# EasyEDA Pro project ProProject_Pet_Tracker_V2_Hardware_PRO.epro, schematic Pet_Tracker_V2_Main_Board
Create Date: 2024-06-01; Page Name: Main_board; Project Name: Pet_Tracker_V2_Hardware_PRO; Schematic Name: Pet_Tracker_V2_Main_Board; Update Date: 2024-06-06; Drawn: Simonas; Version: V1
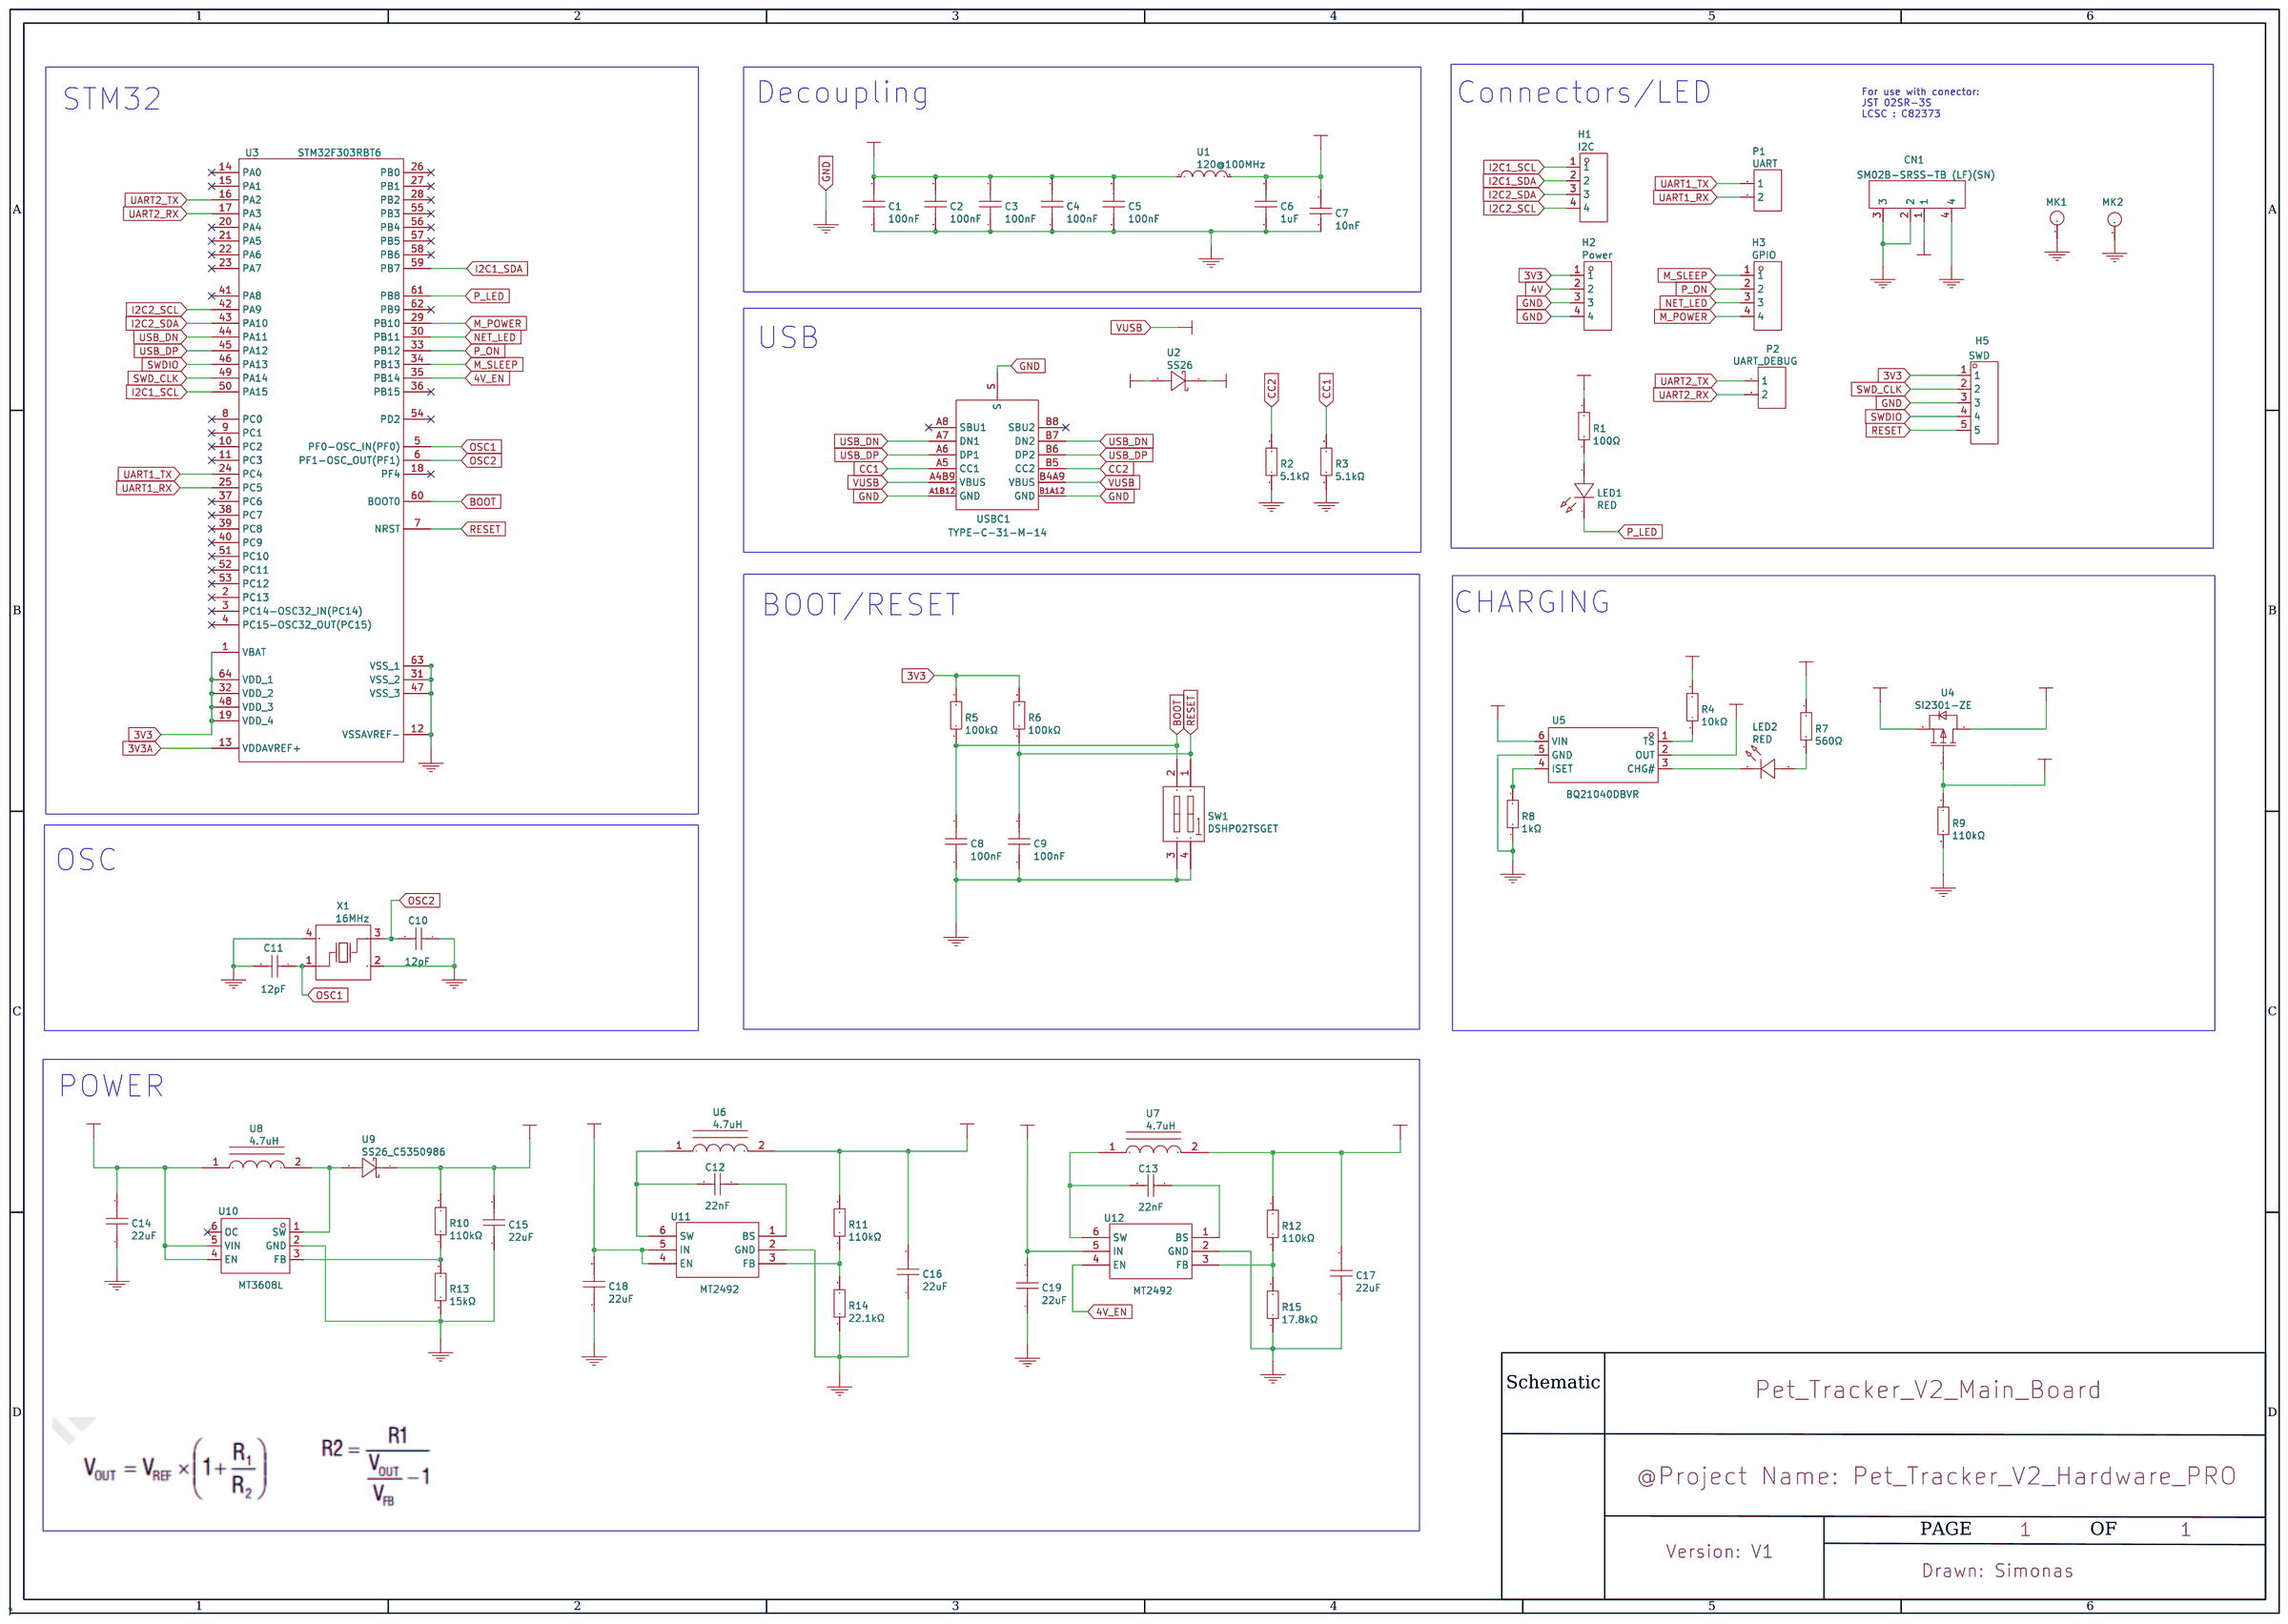
[diagram p0: schematic sheet]

## Parts
C1  100nF  [C0603]
C2  100nF  [C0603]
C3  100nF  [C0603]
C4  100nF  [C0603]
C5  100nF  [C0603]
C6  1uF  [C0603]
C7  10nF  [C0603]
C8  100nF  [C0603]
C9  100nF  [C0603]
C10  12pF  [C0603]
C11  12pF  [C0603]
C12  22nF  [C0603]
C13  22nF  [C0603]
C14  22uF  [C0603]
C15  22uF  [C0603]
C16  22uF  [C0603]
C17  22uF  [C0603]
C18  22uF  [C0603]
C19  22uF  [C0603]
CN1  SM02B-SRSS-TB (LF)(SN)  [CONN-SMD_2P-P1.00_SM02B-SRSS-TB-LF-SN]
H1  I2C  [HDR-TH_4P-P2.54-V-F]
H2  Power  [HDR-TH_4P-P2.54-V-F]
H3  GPIO  [HDR-TH_4P-P2.54-V-F]
H5  SWD  [HEADER_1X5_1.27MM]
LED1  RED  [LED0603-RD_RED]
LED2  RED  [LED0603-RD_RED]
MK1  Mounting_Hole_PAD  [MOUNTINGHOLE_2.2MM_M2_PAD]
MK2  Mounting_Hole_PAD  [MOUNTINGHOLE_2.2MM_M2_PAD]
P1  UART  [HDR-TH_2P-P2.54-V-F]
P2  UART_DEBUG  [HDR-TH_2P-P2.54-V-F]
R1  100Ω  [R0603]
R2  5.1kΩ  [R0603]
R3  5.1kΩ  [R0603]
R4  10kΩ  [R0603]
R5  100kΩ  [R0603]
R6  100kΩ  [R0603]
R7  560Ω  [R0603]
R8  1kΩ  [R0603]
R9  110kΩ  [R0603]
R10  110kΩ  [R0603]
R11  110kΩ  [R0603]
R12  110kΩ  [R0603]
R13  15kΩ  [R0603]
R14  22.1kΩ  [R0603]
R15  17.8kΩ  [R0603]
SW1  DSHP02TSGET  [SW-SMD_4P_DSHP02TSGET]
U1  120@100MHz  [L0603]
U2  SS26  [SMA_L4.3-W2.6-LS5.1-RD]
U3  STM32F303RBT6  [LQFP-64_L10.0-W10.0-P0.50-LS12.0-BL]
U4  SI2301-ZE  [SOT-23-3_L2.9-W1.3-P1.90-LS2.4-BR]
U5  BQ21040DBVR  [SOT-23-6_L2.9-W1.6-P0.95-LS2.8-BR]
U6  4.7uH  [IND-SMD_L4.4-W4.2]
U7  4.7uH  [IND-SMD_L4.4-W4.2]
U8  4.7uH  [IND-SMD_L4.4-W4.2]
U9  SS26_C5350986  [SMA_L4.3-W2.6-LS5.1-RD]
U10  MT3608L  [SOT-23-6_L2.9-W1.7-P0.95-LS2.8-BL]
U11  MT2492  [SOT-23-6_L2.9-W1.6-P0.95-LS2.8-BL]
U12  MT2492  [SOT-23-6_L2.9-W1.6-P0.95-LS2.8-BL]
USBC1  TYPE-C-31-M-14  [USB-C-SMD_12P-P0.50-H-F_TYPE-C-31-M-14]
X1  16MHz  [OSC-SMD_4P-L3.2-W2.5-BL]

## Library data of the parts
C1-C5 C8 C9 = 100nF: Supplier: LCSC; Manufacturer: SAMSUNG(三星); Manufacturer Part: CL10B104KB8NNNC; Supplier Part: C1591; JLCPCB Part Class: Extended Part
C6 = 1uF: Supplier: LCSC; Manufacturer Part: CL10A105KB8NNNC; Manufacturer: SAMSUNG(三星); Supplier Part: C15849; JLCPCB Part Class: Basic Part
C7 = 10nF: Supplier: LCSC; Manufacturer Part: CL10B103KB8NNNC; Manufacturer: SAMSUNG(三星); Supplier Part: C1589; JLCPCB Part Class: Extended Part
C10 C11 = 12pF: Supplier: LCSC; Manufacturer: YAGEO(国巨); Manufacturer Part: CC0603JRNPO9BN120; Supplier Part: C107034; JLCPCB Part Class: Extended Part
C12 C13 = 22nF: Supplier: LCSC; Manufacturer: FH(风华); Manufacturer Part: 0603B223K500NT; Supplier Part: C77571; JLCPCB Part Class: Extended Part
C14-C19 = 22uF: Supplier: LCSC; Manufacturer: SAMSUNG(三星); Manufacturer Part: CL10A226MQ8NRNC; Supplier Part: C59461; JLCPCB Part Class: Basic Part
CN1 = SM02B-SRSS-TB (LF)(SN): Supplier: LCSC; Supplier Part: C160402; Manufacturer: JST; Manufacturer Part: SM02B-SRSS-TB(LF)(SN); JLCPCB Part Class: Extended Part
H1 = I2C: Supplier: LCSC; Supplier Part: C2718488; Manufacturer: BOOMELE(博穆精密); Manufacturer Part: 2.54-1*4P母; JLCPCB Part Class: Extended Part
H2 = Power: Supplier: LCSC; Supplier Part: C2718488; Manufacturer: BOOMELE(博穆精密); Manufacturer Part: 2.54-1*4P母; JLCPCB Part Class: Extended Part
H3 = GPIO: Supplier: LCSC; Supplier Part: C2718488; Manufacturer: BOOMELE(博穆精密); Manufacturer Part: 2.54-1*4P母; JLCPCB Part Class: Extended Part
H5 = SWD: Supplier: LCSC; Manufacturer: null; Manufacturer Part: 排针 1*4P; Supplier Part: C59481; JLCPCB Part Class: Extended Part
LED1 LED2 = RED: Supplier: LCSC; Supplier Part: C965799; Manufacturer: XINGLIGHT(成兴光); Manufacturer Part: XL-1608SURC-06; JLCPCB Part Class: Extended Part
MK1 MK2 = Mounting_Hole_PAD: license: https://www.gnu.org/licenses/lgpl-2.1.html
P1 = UART: Supplier: LCSC; Manufacturer: BOOMELE(博穆精密); Manufacturer Part: 2.54-1*2P母; Supplier Part: C49661; JLCPCB Part Class: Extended Part
P2 = UART_DEBUG: Supplier: LCSC; Manufacturer: BOOMELE(博穆精密); Manufacturer Part: 2.54-1*2P母; Supplier Part: C49661; JLCPCB Part Class: Extended Part
R1 = 100Ω: Supplier: LCSC; Manufacturer: YAGEO(国巨); Manufacturer Part: RC0603FR-07100RL; Supplier Part: C105588; JLCPCB Part Class: Extended Part
R2 R3 = 5.1kΩ: Supplier: LCSC; Manufacturer Part: 0603WAF5101T5E; Manufacturer: UNI-ROYAL(厚声); Supplier Part: C23186; JLCPCB Part Class: Basic Part
R4 = 10kΩ: Supplier: LCSC; Manufacturer: YAGEO(国巨); Manufacturer Part: RC0603FR-0710KL; Supplier Part: C98220; JLCPCB Part Class: Extended Part
R5 R6 = 100kΩ: Supplier: LCSC; Supplier Part: C14675; Manufacturer: YAGEO(国巨); Manufacturer Part: RC0603FR-07100KL; JLCPCB Part Class: Extended Part
R7 = 560Ω: Supplier: LCSC; Manufacturer: UNI-ROYAL(厚声); Manufacturer Part: 0603WAJ0561T5E; Supplier Part: C25247; JLCPCB Part Class: Extended Part
R8 = 1kΩ: Supplier: LCSC; Manufacturer: UNI-ROYAL(厚声); Manufacturer Part: 0603WAF1001T5E; Supplier Part: C21190; JLCPCB Part Class: Basic Part
R9-R12 = 110kΩ: Supplier: LCSC; Manufacturer: UNI-ROYAL(厚声); Manufacturer Part: 0603WAF1103T5E; Supplier Part: C25805; JLCPCB Part Class: Extended Part
R13 = 15kΩ: Supplier: LCSC; Manufacturer: UNI-ROYAL(厚声); Manufacturer Part: 0603WAF1502T5E; Supplier Part: C22809; JLCPCB Part Class: Basic Part
R14 = 22.1kΩ: Supplier: LCSC; Manufacturer: UNI-ROYAL(厚声); Manufacturer Part: 0603WAF2212T5E; Supplier Part: C25961; JLCPCB Part Class: Extended Part
R15 = 17.8kΩ: Supplier: LCSC; Supplier Part: C185364; Manufacturer: YAGEO(国巨); Manufacturer Part: RC0603FR-0717K8L; JLCPCB Part Class: Extended Part
SW1 = DSHP02TSGET: Supplier: LCSC; Manufacturer: YE; Supplier Part: C40735; JLCPCB Part Class: Extended Part
U1 = 120@100MHz: Supplier: LCSC; Supplier Part: C14709; Manufacturer: muRata(村田); Manufacturer Part: BLM18PG121SN1D; JLCPCB Part Class: Extended Part
U2 = SS26: Supplier: LCSC; Supplier Part: C5350986; Manufacturer: ElecSuper(静芯微); JLCPCB Part Class: Extended Part
U3 = STM32F303RBT6: Voltage - Supply: 2V ~ 3.6V; Supplier: LCSC; Manufacturer: ST(意法半导体); Supplier Part: C130453; JLCPCB Part Class: Extended Part
U4 = SI2301-ZE: Supplier: LCSC; Supplier Part: C5261052; Manufacturer: HXY MOSFET(华轩阳电子); JLCPCB Part Class: Extended Part
U5 = BQ21040DBVR: Supplier: LCSC; Supplier Part: C202311; Manufacturer: TI(德州仪器); JLCPCB Part Class: Extended Part
U6-U8 = 4.7uH: Supplier: LCSC; Supplier Part: C2921168; Manufacturer: BC(台湾诚阳); Manufacturer Part: BCIHP0420SC-4R7M; JLCPCB Part Class: Extended Part
U9 = SS26_C5350986: Supplier: LCSC; Supplier Part: C5350986; Manufacturer: ElecSuper(静芯微); Manufacturer Part: SS26; JLCPCB Part Class: Extended Part
U10 = MT3608L: Supplier: LCSC; Supplier Part: C2932326; Manufacturer: 西安航天民芯; JLCPCB Part Class: Extended Part
U11 U12 = MT2492: Supplier: LCSC; Manufacturer: 西安航天民芯; Supplier Part: C89358; JLCPCB Part Class: Extended Part
USBC1 = TYPE-C-31-M-14: Supplier: LCSC; Supplier Part: C223907; Manufacturer: 韩国韩荣; JLCPCB Part Class: Extended Part
X1 = 16MHz: Supplier: LCSC; Manufacturer: YXC(扬兴晶振); Manufacturer Part: X322516MLB4SI; Supplier Part: C13738; JLCPCB Part Class: Basic Part

## Nets
3V3: C1.2 C2.2 C3.2 C4.2 C5.2 C16.2 H2.1 H5.1 R1.2 R5.2 R6.2 R11.2 U1.1 U3.1(VBAT) U3.19(VDD_4) U3.32(VDD_2) U3.48(VDD_3) U3.64(VDD_1) U6.2
3V3A: C6.2 C7.2 U1.2 U3.13(VDDAVREF+)
4V: C17.2 H2.2 R12.2 U7.2
4V_EN: U3.35(PB14) U12.4(EN)
5V: C15.2 C18.2 C19.2 R10.2 U9.1(K) U11.4(EN) U11.5(IN) U12.5(IN)
GND: C1.1 C2.1 C3.1 C4.1 C5.1 C6.1 C7.1 C8.1 C9.1 C10.1 C11.1 C14.1 C15.1 C16.1 C17.1 C18.1 C19.1 CN1.2 CN1.3 CN1.4 H2.3 H2.4 H5.3 MK1.1 MK2.1 R2.1 R3.1 R8.1 R9.2 R13.1 R14.1 R15.1 SW1.3(B2) SW1.4(B1) U3.12(VSSAVREF-) U3.31(VSS_2) U3.47(VSS_3) U3.63(VSS_1) U5.5(GND) U10.2(GND) U11.2(GND) U12.2(GND) USBC1.A1B12(GND) USBC1.B1A12(GND) USBC1.S X1.2(GND) X1.4(GND)
VIN: C14.2 U2.1(K) U4.3(D) U8.1 U10.4(EN) U10.5(VIN)
BOOT: C8.2 R5.1 SW1.2(A2) U3.60(BOOT0)
CC1: R3.2 USBC1.A5(CC1)
CC2: R2.2 USBC1.B5(CC2)
I2C1_SCL: H1.1 U3.50(PA15)
I2C1_SDA: H1.2 U3.59(PB7)
I2C2_SCL: H1.4 U3.42(PA9)
I2C2_SDA: H1.3 U3.43(PA10)
M_POWER: H3.4 U3.29(PB10)
M_SLEEP: H3.1 U3.34(PB13)
NET_LED: H3.3 U3.30(PB11)
OSC1: C11.2 U3.5(PF0-OSC_IN(PF0)) X1.1(OSC1)
OSC2: C10.2 U3.6(PF1-OSC_OUT(PF1)) X1.3(OSC2)
P_LED: LED1.1(K) U3.61(PB8)
P_ON: H3.2 U3.33(PB12)
RESET: C9.2 H5.5 R6.1 SW1.1(A1) U3.7(NRST)
SWD_CLK: H5.2 U3.49(PA14)
SWDIO: H5.4 U3.46(PA13)
UART1_RX: P1.2 U3.25(PC5)
UART1_TX: P1.1 U3.24(PC4)
UART2_RX: P2.2 U3.17(PA3)
UART2_TX: P2.1 U3.16(PA2)
USB_DN: U3.44(PA11) USBC1.A7(DN1) USBC1.B7(DN2)
USB_DP: U3.45(PA12) USBC1.A6(DP1) USBC1.B6(DP2)
VB: CN1.1 U4.2(S) U5.2(OUT)
VUSB: R4.2 R7.2 R9.1 U2.2(A) U4.1(G) U5.6(VIN) USBC1.A4B9(VBUS) USBC1.B4A9(VBUS)
C13_1: C13.1 U12.1(BS)
C13_2: C13.2 U7.1 U12.6(SW)
LED1_2: LED1.2(A) R1.1
LED2_2: LED2.2(A) R7.1
R12_1: R12.1 R15.2 U12.3(FB)
U5_1: R4.1 U5.1(TS)
U5_3: LED2.1(K) U5.3(CHG#)
U5_4: R8.2 U5.4(ISET)
U10_1: U8.2 U9.2(A) U10.1(SW)
U10_3: R10.1 R13.2 U10.3(FB)
U11_1: C12.1 U11.1(BS)
U11_3: R11.1 R14.2 U11.3(FB)
U11_6: C12.2 U6.1 U11.6(SW)

Not connected (* = marked no-connect by the designer): U3 2(PC13)* 3(PC14-OSC32_IN(PC14))* 4(PC15-OSC32_OUT(PC15))* 8(PC0)* 9(PC1)* 10(PC2)* 11(PC3)* 14(PA0)* 15(PA1)* 18(PF4)* 20(PA4)* 21(PA5)* 22(PA6)* 23(PA7)* 26(PB0)* 27(PB1)* 28(PB2)* 36(PB15)* 37(PC6)* 38(PC7)* 39(PC8)* 40(PC9)* 41(PA8)* 51(PC10)* 52(PC11)* 53(PC12)* 54(PD2)* 55(PB3)* 56(PB4)* 57(PB5)* 58(PB6)* 62(PB9)*; U10 6(OC)*; USBC1 A8(SBU1)* B8(SBU2)*

## Notes on the sheet
- STM32
- Decoupling
- Connectors/LED
- For use with conector:
  JST 02SR-3S
  LCSC : C82373
- USB
- CHARGING
- BOOT/RESET
- OSC
- POWER
